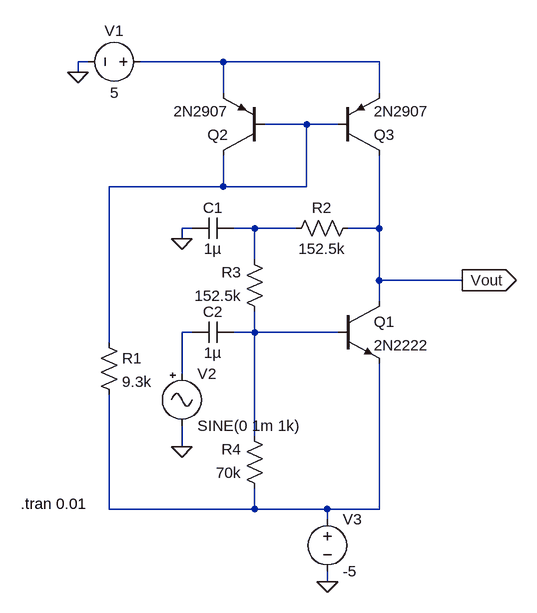
[diagram p0: schematic Test4.asc]
Test4.asc, the LTspice schematic file:
Version 4
SHEET 1 880 680
WIRE 80 -272 64 -272
WIRE 288 -272 160 -272
WIRE 528 -272 288 -272
WIRE 64 -256 64 -272
WIRE 288 -224 288 -272
WIRE 528 -224 528 -272
WIRE 416 -176 352 -176
WIRE 464 -176 416 -176
WIRE 288 -80 288 -128
WIRE 288 -80 112 -80
WIRE 416 -80 416 -176
WIRE 416 -80 288 -80
WIRE 240 -16 224 -16
WIRE 336 -16 304 -16
WIRE 400 -16 336 -16
WIRE 528 -16 528 -128
WIRE 528 -16 480 -16
WIRE 224 0 224 -16
WIRE 336 32 336 -16
WIRE 528 64 528 -16
WIRE 656 64 528 64
WIRE 528 96 528 64
WIRE 240 144 224 144
WIRE 336 144 336 112
WIRE 336 144 304 144
WIRE 464 144 336 144
WIRE 112 160 112 -80
WIRE 224 208 224 144
WIRE 336 304 336 144
WIRE 224 320 224 288
WIRE 112 416 112 240
WIRE 336 416 336 384
WIRE 336 416 112 416
WIRE 448 416 336 416
WIRE 528 416 528 192
WIRE 528 416 448 416
WIRE 448 432 448 416
WIRE 448 528 448 512
FLAG 224 0 0
FLAG 64 -256 0
FLAG 656 64 Vout
IOPIN 656 64 Out
FLAG 448 528 0
FLAG 224 320 0
SYMBOL voltage 176 -272 R90
WINDOW 0 -32 56 VBottom 2
WINDOW 3 32 56 VTop 2
SYMATTR InstName V1
SYMATTR Value 5
SYMBOL res 96 144 R0
SYMATTR InstName R1
SYMATTR Value 9.3k
SYMBOL res 496 -32 R90
WINDOW 0 0 56 VBottom 2
WINDOW 3 32 56 VTop 2
SYMATTR InstName R2
SYMATTR Value 152.5k
SYMBOL res 352 128 R180
WINDOW 0 36 76 Left 2
WINDOW 3 36 40 Left 2
SYMATTR InstName R3
SYMATTR Value 152.5k
SYMBOL res 352 400 R180
WINDOW 0 36 76 Left 2
WINDOW 3 36 40 Left 2
SYMATTR InstName R4
SYMATTR Value 70k
SYMBOL cap 304 -32 R90
WINDOW 0 0 32 VBottom 2
WINDOW 3 32 32 VTop 2
SYMATTR InstName C1
SYMATTR Value 1µ
SYMBOL npn 464 96 R0
SYMATTR InstName Q1
SYMATTR Value 2N2222
SYMBOL cap 304 128 R90
WINDOW 0 0 32 VBottom 2
WINDOW 3 32 32 VTop 2
SYMATTR InstName C2
SYMATTR Value 1µ
SYMBOL pnp 352 -128 R180
SYMATTR InstName Q2
SYMATTR Value 2N2907
SYMBOL pnp 464 -128 M180
SYMATTR InstName Q3
SYMATTR Value 2N2907
SYMBOL voltage 448 416 R0
SYMATTR InstName V3
SYMATTR Value -5
SYMBOL Misc/signal 224 192 R0
SYMATTR InstName V2
SYMATTR Value SINE(0 1m 1k)
TEXT -24 408 Left 2 !.tran 0.01

The netlist it stands for:
* Test4.asc
V1 N001 0 5
R1 N002 N006 9.3k
R2 Vout N003 152.5k
R3 N005 N003 152.5k
R4 N006 N005 70k
C1 N003 0 1µ
Q1 Vout N005 N006 0 2N2222
C2 N005 N004 1µ
Q2 N002 N002 N001 0 2N2907
Q3 Vout N002 N001 0 2N2907
V3 N006 0 -5
V2 N004 0 SINE(0 1m 1k)
.model NPN NPN
.model PNP PNP
.lib standard.bjt
.tran 0.01
.backanno
.end